# EAGLE design vmuzero_SEPS525_V1_0_ICHG100 (EAGLE 6.6.0)

## Sheet 1 of 5
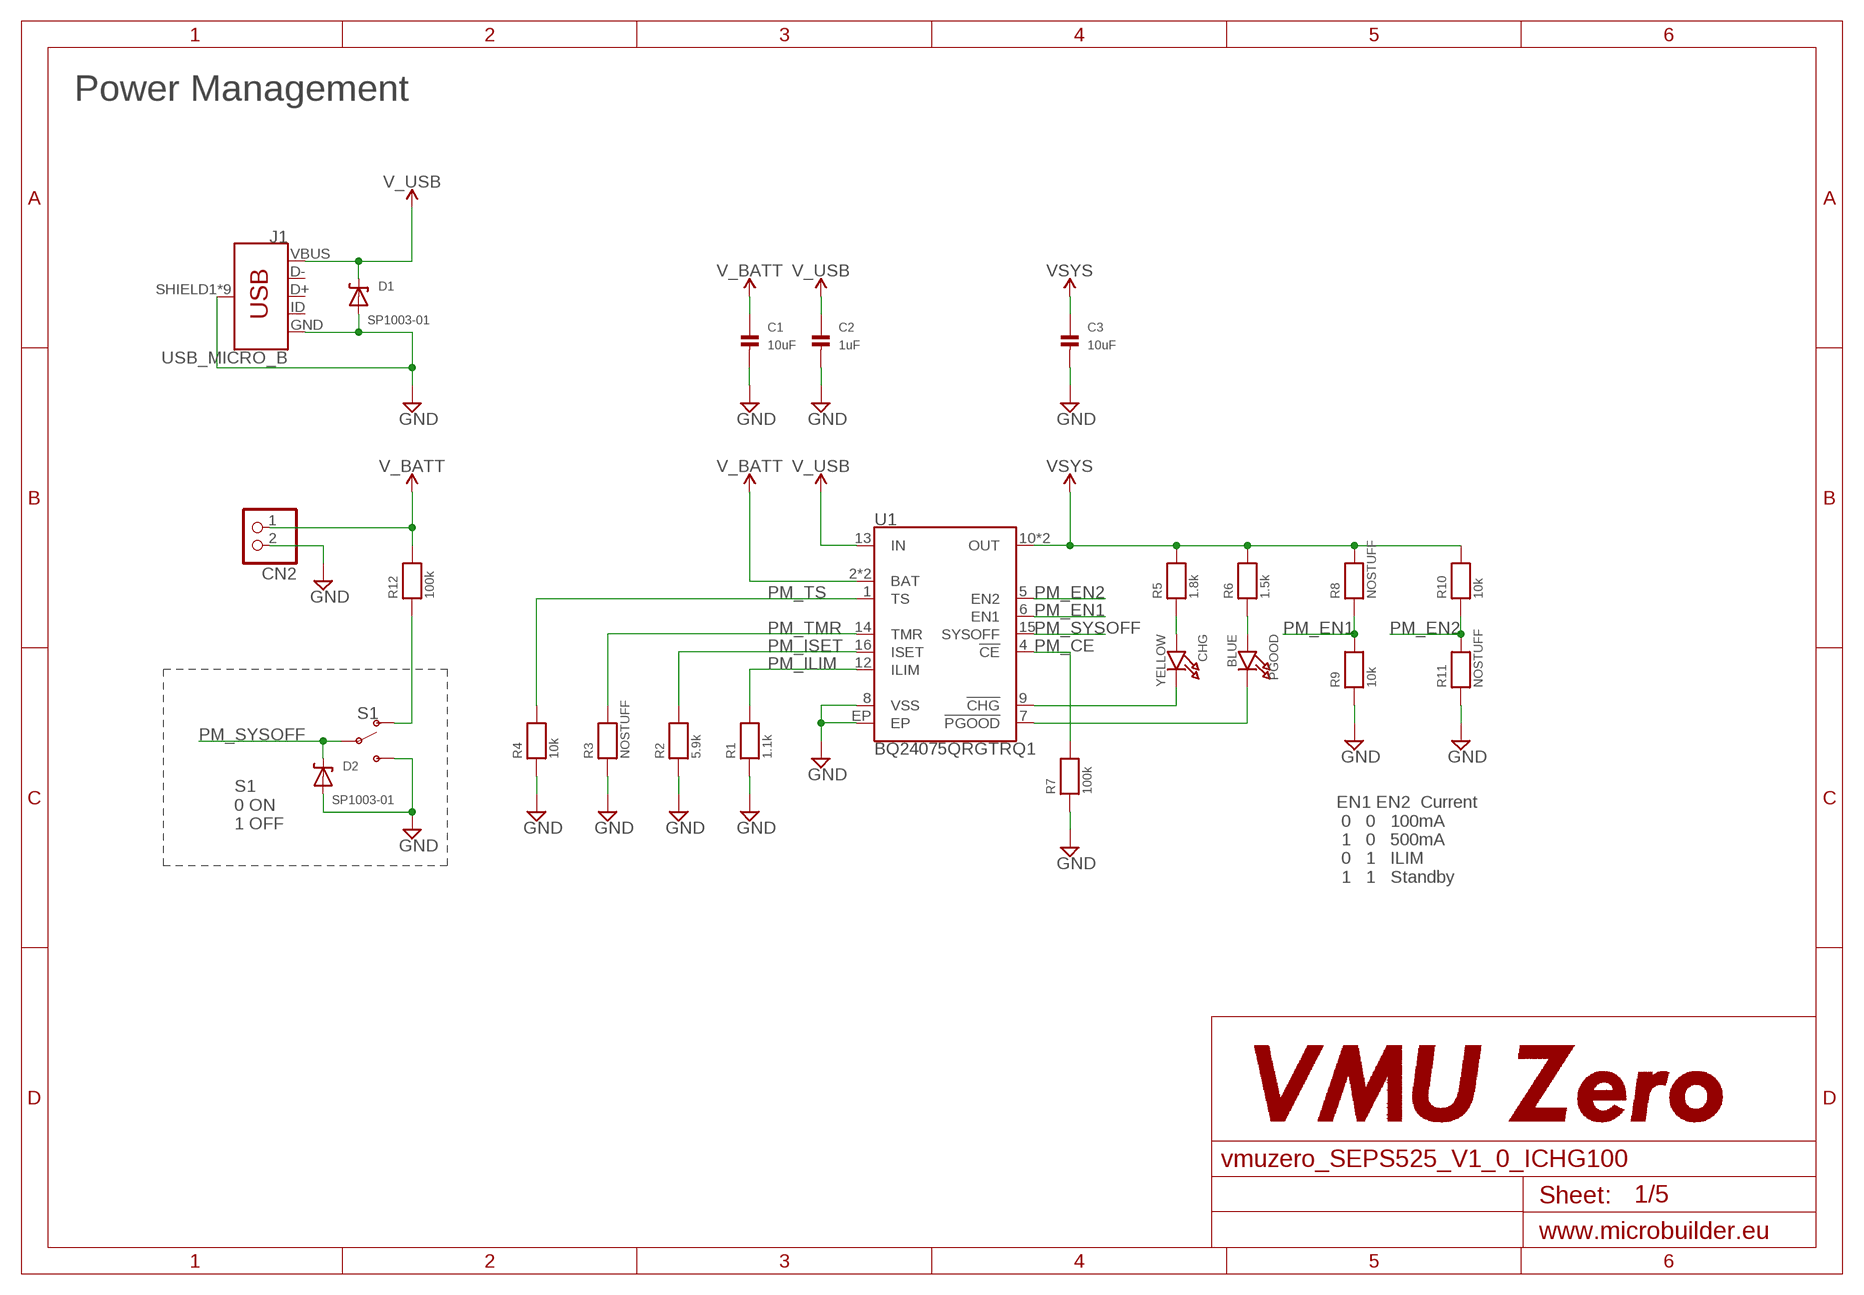
[diagram p0: schematic, sheet 1]

### Parts
C1  10uF  CAP_CERAMIC_0805MP  [_0805MP]
C2  1uF  CAP_CERAMIC_0805MP  [_0805MP]
C3  10uF  CAP_CERAMIC_0805MP  [_0805MP]
CHG  YELLOW  LED0805_NOOUTLINE  [CHIPLED_0805_NOOUTLINE]
CN2  JST_2PIN  [S2B-PH-K-S]
D1  SP1003-01  SP1003-01D  [DIODE_SOD723]
D2  SP1003-01  SP1003-01D  [DIODE_SOD723]
J1  USB_MICRO_B  USB_MICRO-B_CUI_MIBH2  [UJ2-MIBH2-4-SMT]
PGOOD  BLUE  LED0805_NOOUTLINE  [CHIPLED_0805_NOOUTLINE]
R1  1.1k  RESISTOR_0805MP  [_0805MP]
R2  5.9k  RESISTOR_0805MP  [_0805MP]
R3  NOSTUFF  RESISTOR_0805MP  [_0805MP]
R4  10k  RESISTOR_0805MP  [_0805MP]
R5  1.8k  RESISTOR_0805MP  [_0805MP]
R6  1.5k  RESISTOR_0805MP  [_0805MP]
R7  100k  RESISTOR_0805MP  [_0805MP]
R8  NOSTUFF  RESISTOR_0805MP  [_0805MP]
R9  10k  RESISTOR_0805MP  [_0805MP]
R10  10k  RESISTOR_0805MP  [_0805MP]
R11  NOSTUFF  RESISTOR_0805MP  [_0805MP]
R12  100k  RESISTOR_0805MP  [_0805MP]
S1  SWITCH-SPDT  [SPDT_JS102011SAQN]
U1  BQ24075QRGTRQ1  BQ24075  [PVQFN-N16]

### Nets
GND: C1.2 C2.2 C3.2 CN2.2 D1.A D2.A J1.GND J1.SHIELD1(SHIELD) J1.SHIELD2(SHIELD) J1.SHIELD3(SHIELD) J1.SHIELD5(SHIELD) J1.SHIELD6(SHIELD) J1.SHIELD7(SHIELD) J1.SHIELD8(SHIELD) J1.SHIELD9(SHIELD) J1.SHIELD10(SHIELD) R1.1 R2.1 R3.1 R4.1 R7.1 R9.1 R11.1 S1.P$3(S) U1.8(VSS) U1.EP ; also sheet 2,3,4,5
N$1: CHG.C U1.9(!CHG!)
N$2: PGOOD.C U1.7(!PGOOD!)
N$4: R12.1 S1.P$1(O)
N$5: PGOOD.A R6.1
N$6: CHG.A R5.1
PM_CE: R7.2 U1.4(!CE!)
PM_EN1: R8.1 R9.2 U1.6(EN1)
PM_EN2: R10.1 R11.2 U1.5(EN2)
PM_ILIM: R1.2 U1.12(ILIM)
PM_ISET: R2.2 U1.16(ISET)
PM_SYSOFF: D2.C S1.P$2(P) U1.15(SYSOFF)
PM_TMR: R3.2 U1.14(TMR)
PM_TS: R4.2 U1.1(TS)
V_BATT: C1.1 CN2.1 R12.2 U1.2(BAT) U1.3(BAT)
V_USB: C2.1 D1.C J1.VBUS U1.13(IN)
VSYS: C3.1 R5.2 R6.2 R8.2 R10.2 U1.10(OUT) U1.11(OUT) ; also sheet 2,4,5
Unconnected: J1.D+ J1.D- J1.ID

### Notes on the sheet
- Power Management
- S1
  0 ON
  1 OFF
- EN1 EN2  Current
   0   0   100mA
   1   0   500mA
   0   1   ILIM
   1   1   Standby

## Sheet 2 of 5
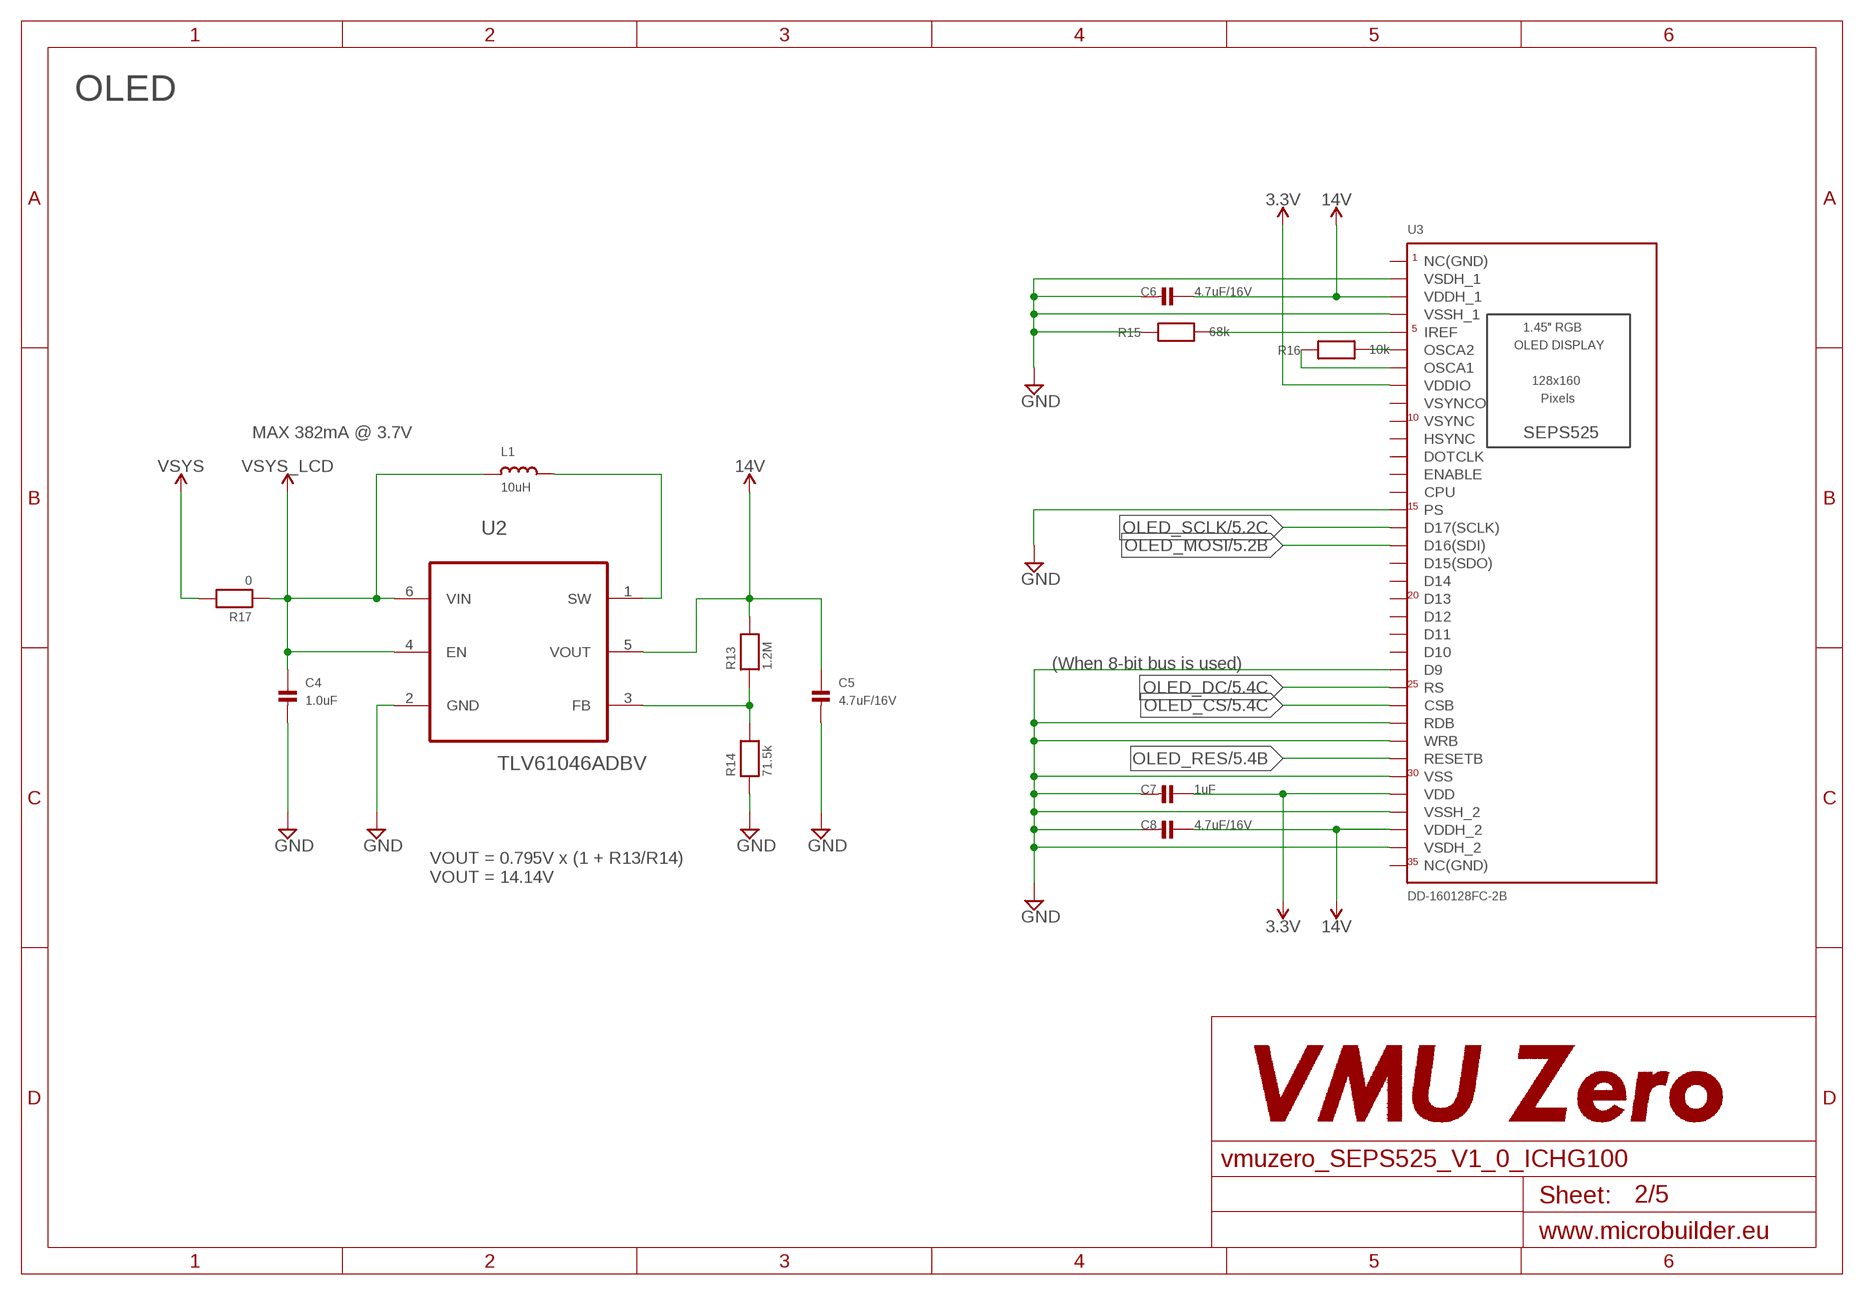
[diagram p1: schematic, sheet 2]

### Parts
C4  1.0uF  CAP_CERAMIC_0805MP  [_0805MP]
C5  4.7uF/16V  CAP_CERAMIC_0805MP  [_0805MP]
C6  4.7uF/16V  CAP_CERAMIC_0805MP  [_0805MP]
C7  1uF  CAP_CERAMIC_0805MP  [_0805MP]
C8  4.7uF/16V  CAP_CERAMIC_0805MP  [_0805MP]
L1  10uH  INDUCTOR_LQH2  [LQH2]
R13  1.2M  RESISTOR_0805MP  [_0805MP]
R14  71.5k  RESISTOR_0805MP  [_0805MP]
R15  68k  RESISTOR_0805MP  [_0805MP]
R16  10k  RESISTOR_0805MP  [_0805MP]
R17  0  RESISTOR_0805MP  [_0805MP]
U2  TLV61046ADBV  [R-PDSO-G6]
U3  DD-160128FC-2B  DISP_OLED_DD-160128FC-2BNOSWAP  [XF2M-3515-1A]

### Nets
3.3V: C7.1 U3.8(VDDIO) U3.31(VDD) ; also sheet 5
14V: C5.1 C6.1 C8.1 R13.2 U2.5(VOUT) U3.3(VDDH_1) U3.33(VDDH_2)
GND: C4.2 C5.2 C6.2 C7.2 C8.2 R14.1 R15.2 U2.2(GND) U3.2(VSDH_1) U3.4(VSSH_1) U3.15(PS) U3.24(D9) U3.27(RDB) U3.28(WRB) U3.30(VSS) U3.32(VSSH_2) U3.34(VSDH_2) ; also sheet 1,3,4,5
N$7: R15.1 U3.5(IREF)
N$8: L1.P$2 U2.1(SW)
N$9: R13.1 R14.2 U2.3(FB)
N$10: R16.1 U3.6(OSCA2)
N$11: R16.2 U3.7(OSCA1)
OLED_CS: U3.26(CSB) ; also sheet 5
OLED_DC: U3.25(RS) ; also sheet 5
OLED_MOSI: U3.17(D16(SDI)) ; also sheet 5
OLED_RES: U3.29(RESETB) ; also sheet 5
OLED_SCLK: U3.16(D17(SCLK)) ; also sheet 5
VSYS: R17.2 ; also sheet 1,4,5
VSYS_LCD: C4.1 L1.P$1 R17.1 U2.4(EN) U2.6(VIN)
Unconnected: U3.1(NC(GND)) U3.9(VSYNCO) U3.10(VSYNC) U3.11(HSYNC) U3.12(DOTCLK) U3.13(ENABLE) U3.14(CPU) U3.18(D15(SDO)) U3.19(D14) U3.20(D13) U3.21(D12) U3.22(D11) U3.23(D10) U3.35(NC(GND))

### Notes on the sheet
- OLED
- MAX 382mA @ 3.7V
- (When 8-bit bus is used)
- VOUT = 0.795V x (1 + R13/R14)
  VOUT = 14.14V

## Sheet 3 of 5
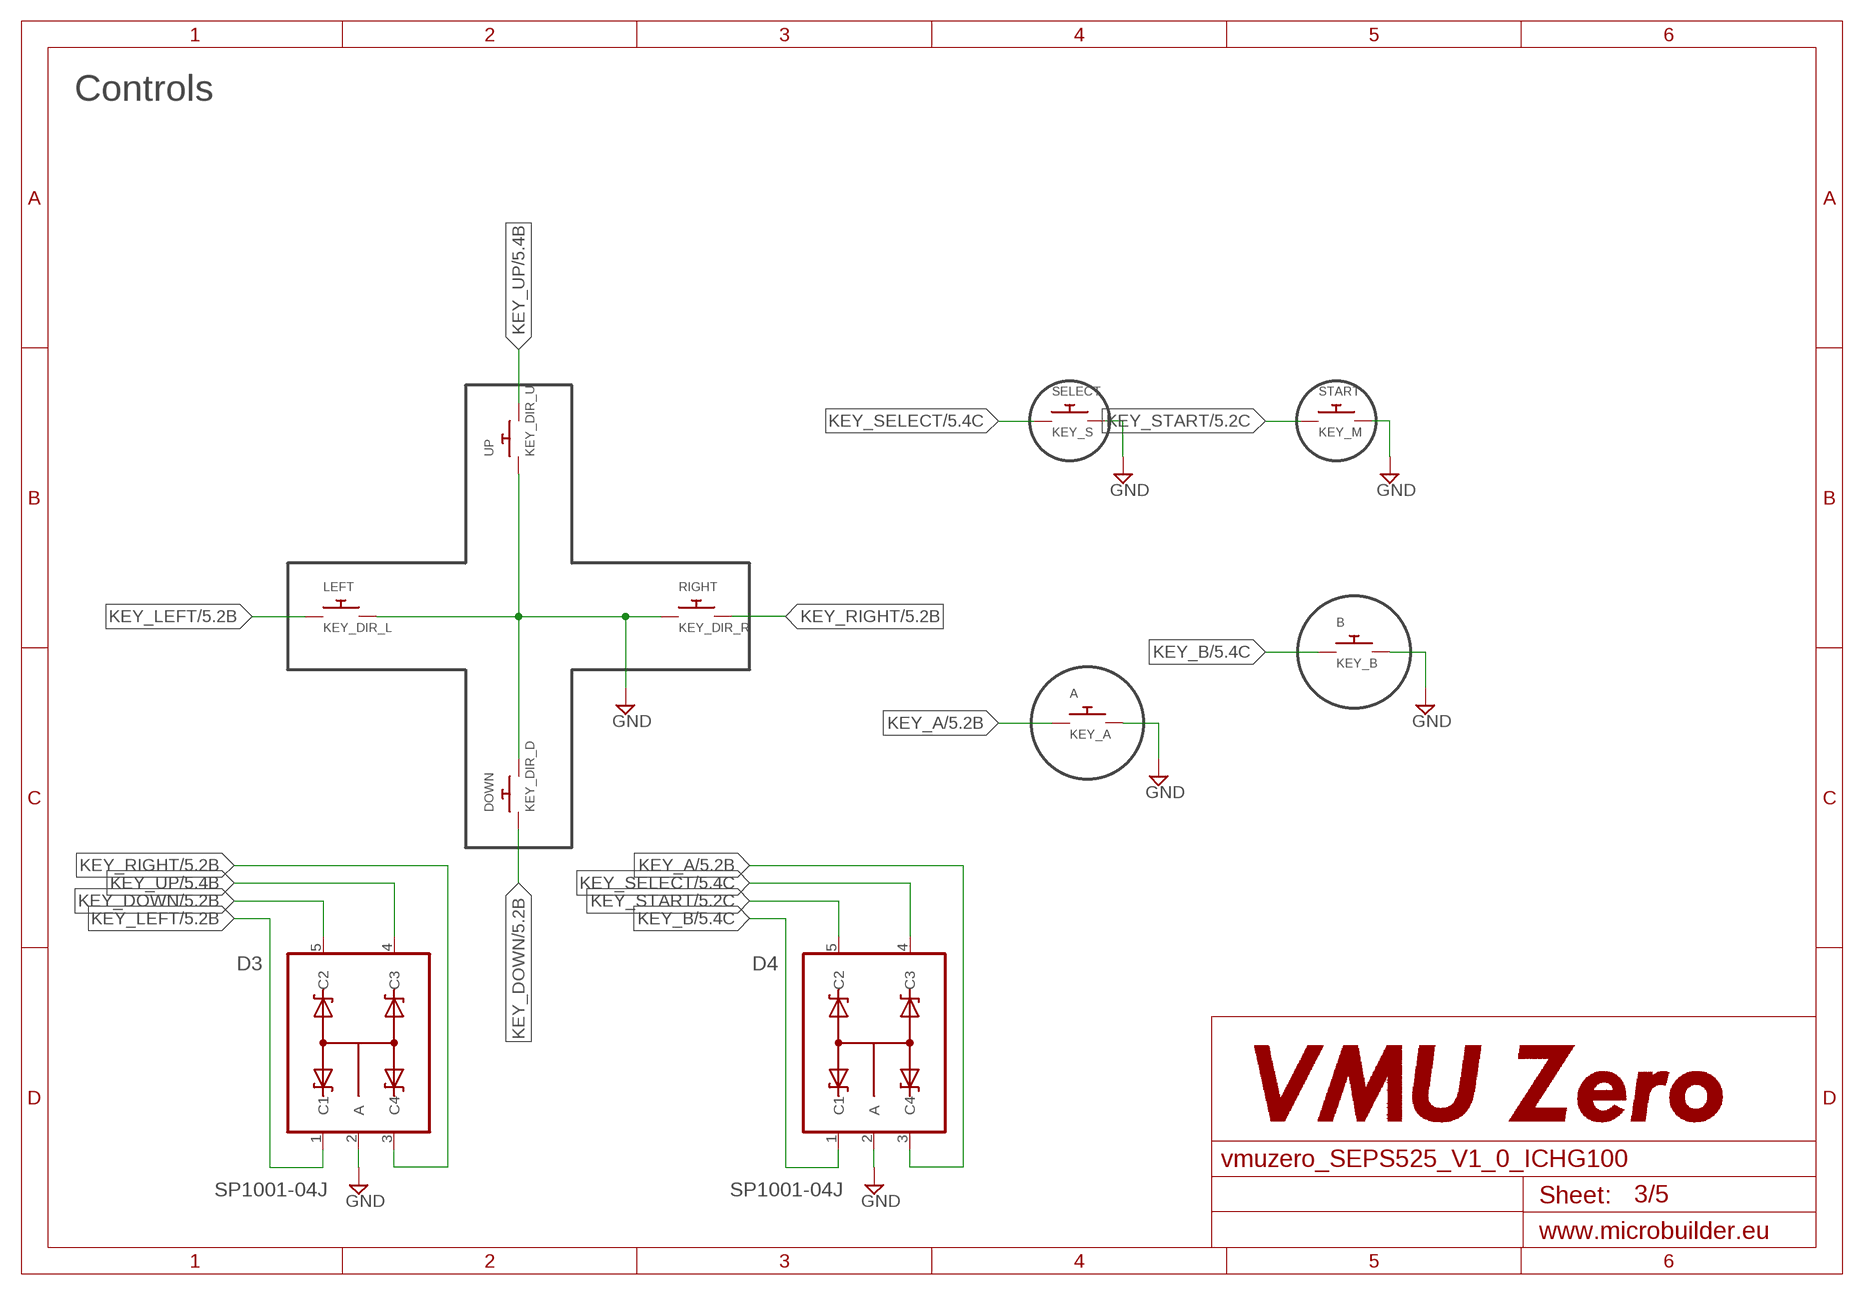
[diagram p2: schematic, sheet 3]

### Parts
A  KEY_A  SWITCH_PUSH_VMU  [KEYPAD_VMU_R26]
B  KEY_B  SWITCH_PUSH_VMU  [KEYPAD_VMU_R26]
D3  SP1001-04J  [SC70-5]
D4  SP1001-04J  [SC70-5]
DOWN  KEY_DIR_D  SWITCH_PUSH_VMU  [KEYPAD_VMU_R26]
LEFT  KEY_DIR_L  SWITCH_PUSH_VMU  [KEYPAD_VMU_R26]
RIGHT  KEY_DIR_R  SWITCH_PUSH_VMU  [KEYPAD_VMU_R26]
SELECT  KEY_S  SWITCH_PUSH_VMU  [KEYPAD_VMU_R26]
START  KEY_M  SWITCH_PUSH_VMU  [KEYPAD_VMU_R26]
UP  KEY_DIR_U  SWITCH_PUSH_VMU  [KEYPAD_VMU_R26]

### Nets
GND: A.2 B.2 D3.2(A) D4.2(A) DOWN.2 LEFT.2 RIGHT.1 SELECT.2 START.2 UP.1 ; also sheet 1,2,4,5
KEY_A: A.1 D4.3(C4) ; also sheet 5
KEY_B: B.1 D4.1(C1) ; also sheet 5
KEY_DOWN: D3.5(C2) DOWN.1 ; also sheet 5
KEY_LEFT: D3.1(C1) LEFT.1 ; also sheet 5
KEY_RIGHT: D3.3(C4) RIGHT.2 ; also sheet 5
KEY_SELECT: D4.4(C3) SELECT.1 ; also sheet 5
KEY_START: D4.5(C2) START.1 ; also sheet 5
KEY_UP: D3.4(C3) UP.2 ; also sheet 5

### Notes on the sheet
- Controls

## Sheet 4 of 5
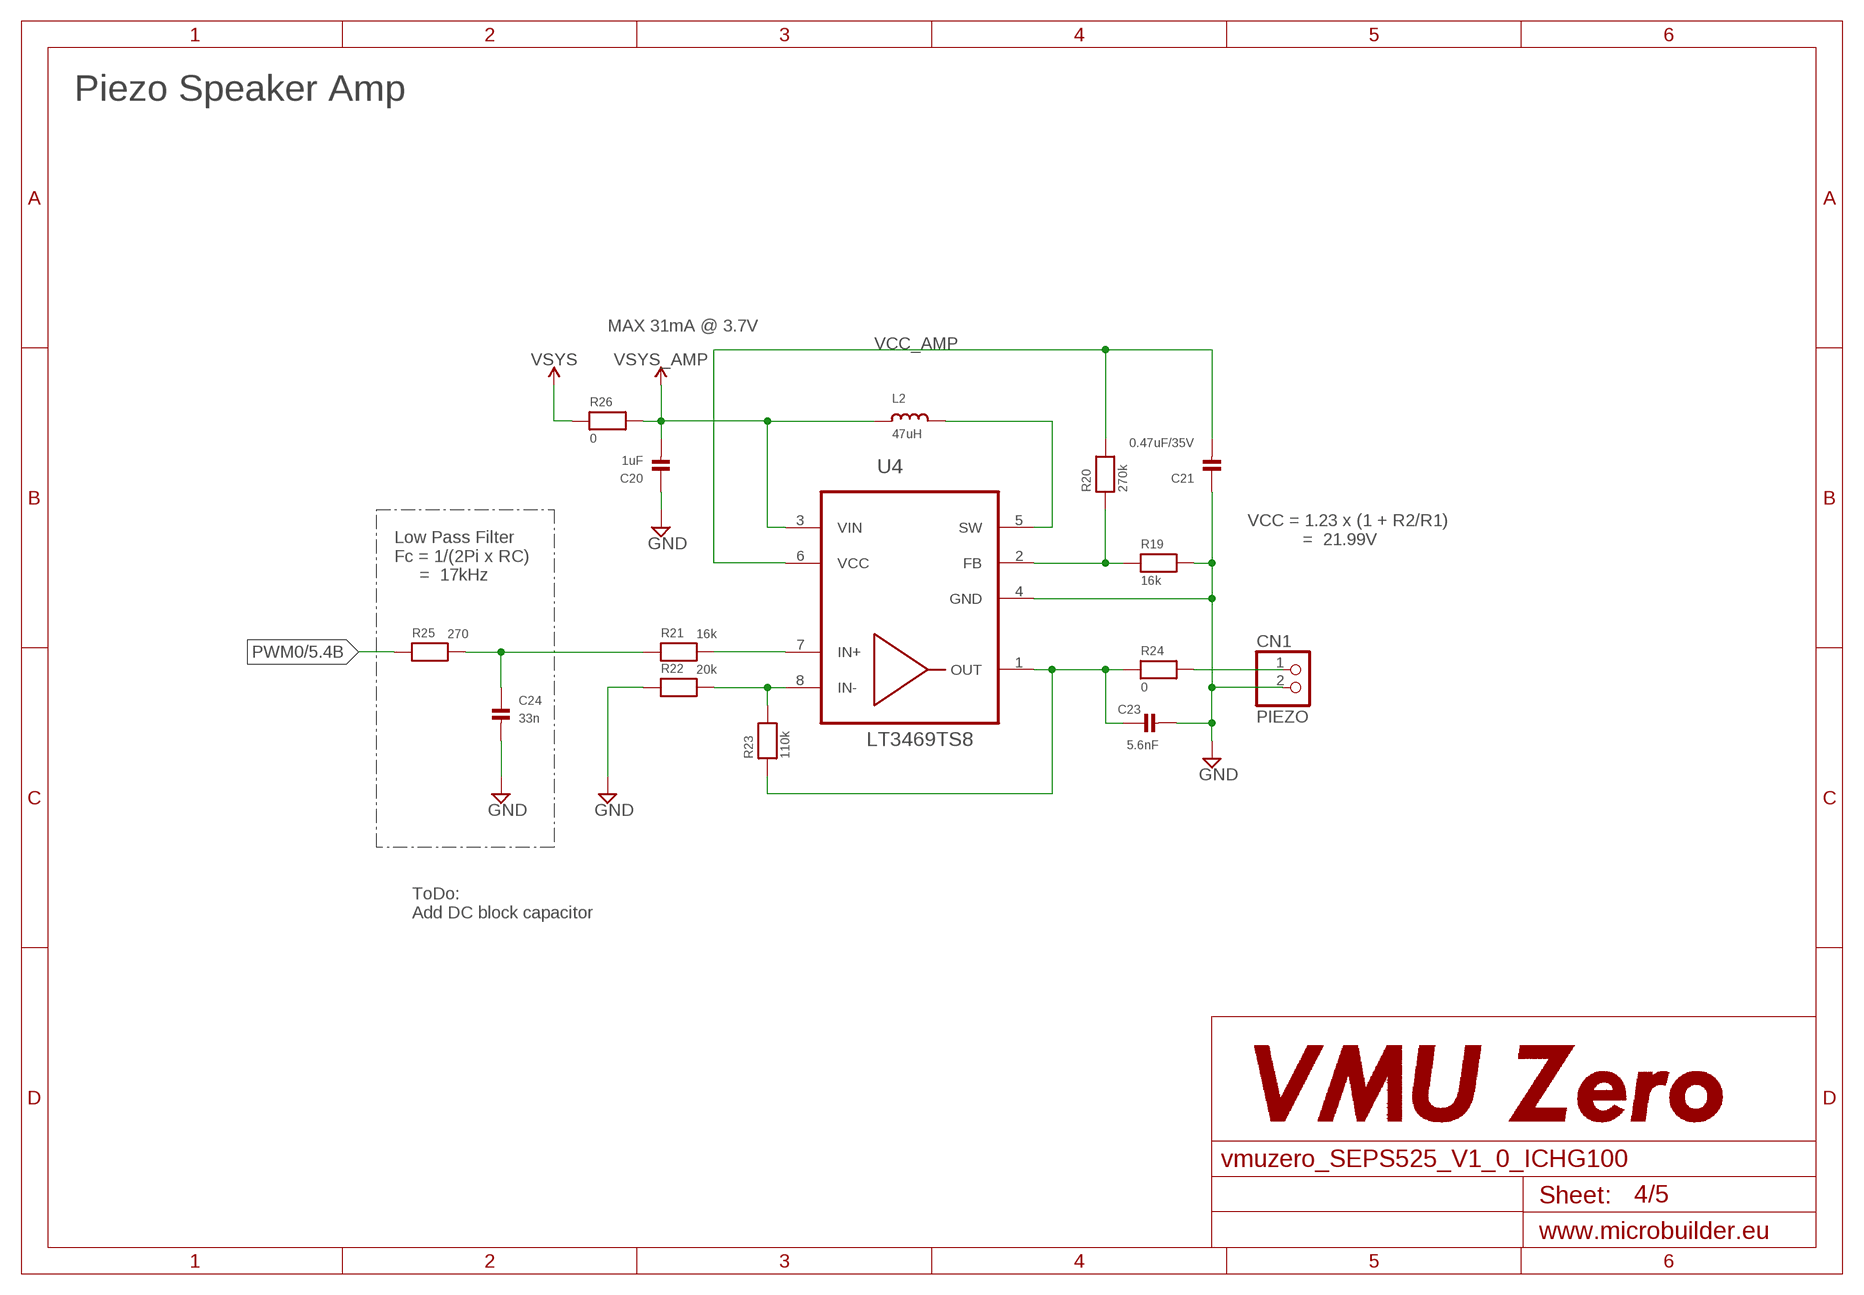
[diagram p3: schematic, sheet 4]

### Parts
C20  1uF  CAP_CERAMIC_0805MP  [_0805MP]
C21  0.47uF/35V  CAP_CERAMIC_0805MP  [_0805MP]
C23  5.6nF  CAP_CERAMIC_0805MP  [_0805MP]
C24  33n  CAP_CERAMIC_0805MP  [_0805MP]
CN1  PIEZO  HEADER-1X2ROUND  [1X02_ROUND]
L2  47uH  INDUCTOR_LQH32C  [LQH32C]
R19  16k  RESISTOR_0805MP  [_0805MP]
R20  270k  RESISTOR_0805MP  [_0805MP]
R21  16k  RESISTOR_0805MP  [_0805MP]
R22  20k  RESISTOR_0805MP  [_0805MP]
R23  110k  RESISTOR_0805MP  [_0805MP]
R24  0  RESISTOR_0805MP  [_0805MP]
R25  270  RESISTOR_0805MP  [_0805MP]
R26  0  RESISTOR_0805MP  [_0805MP]
U4  LT3469TS8  [TSOT-23-8]

### Nets
GND: C20.1 C21.1 C23.2 C24.2 CN1.2 R19.2 R22.1 U4.4(GND) ; also sheet 1,2,3,5
N$14: L2.P$2 U4.5(SW)
N$16: R19.1 R20.1 U4.2(FB)
N$17: C23.1 R23.1 R24.1 U4.1(OUT)
N$18: R22.2 R23.2 U4.8(IN-)
N$19: CN1.1 R24.2
N$20: C24.1 R21.1 R25.2
N$21: R21.2 U4.7(IN+)
PWM0: R25.1 ; also sheet 5
VCC_AMP: C21.2 R20.2 U4.6(VCC)
VSYS: R26.1 ; also sheet 1,2,5
VSYS_AMP: C20.2 L2.P$1 R26.2 U4.3(VIN)

### Notes on the sheet
- Piezo Speaker Amp
- MAX 31mA @ 3.7V
- VCC = 1.23 x (1 + R2/R1)
             =  21.99V
- Low Pass Filter
  Fc = 1/(2Pi x RC)
       =  17kHz
- ToDo:
  Add DC block capacitor

## Sheet 5 of 5
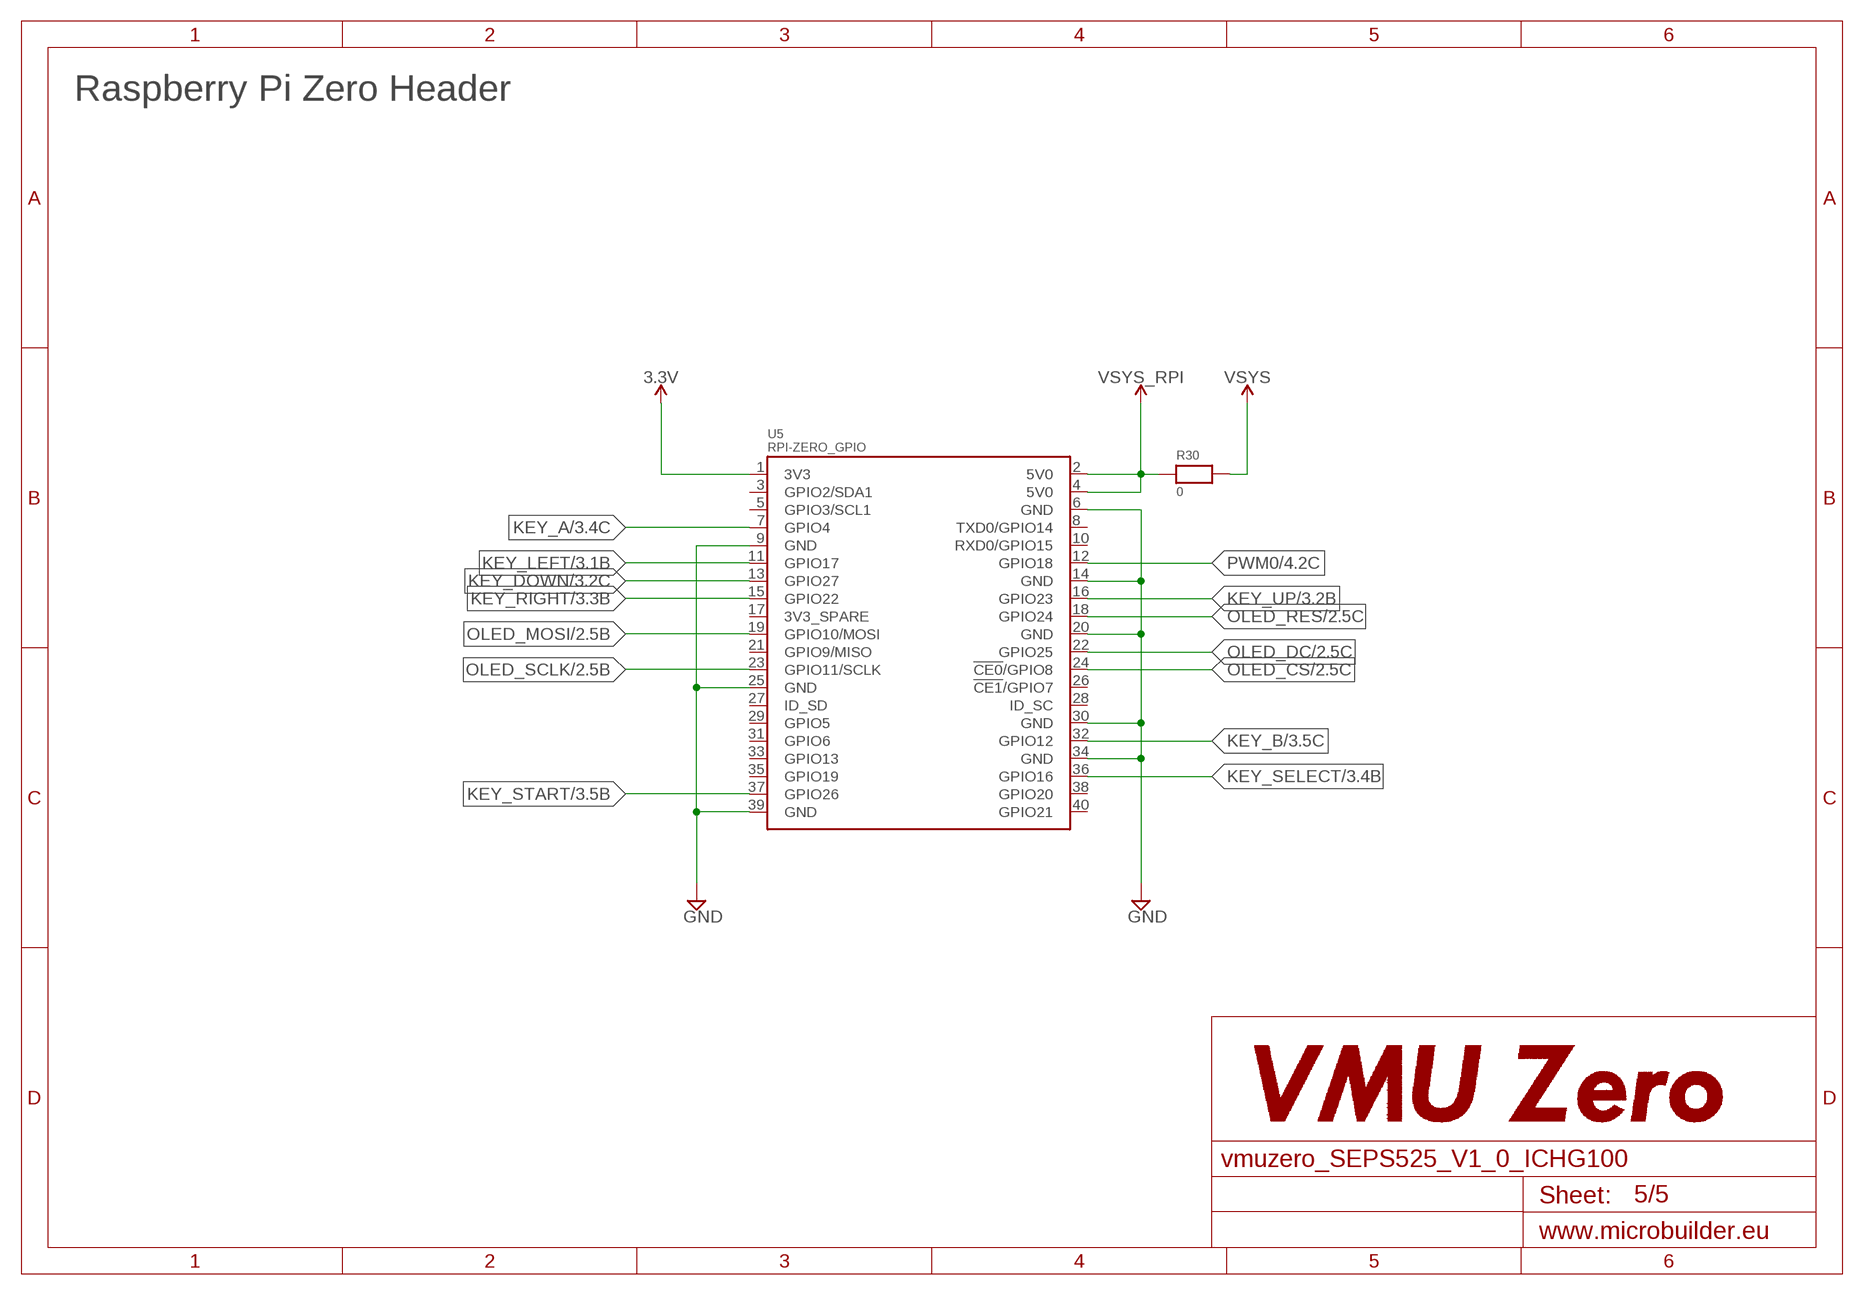
[diagram p4: schematic, sheet 5]

### Parts
R30  0  RESISTOR_0805MP  [_0805MP]
U5  RPI-ZERO_GPIO  [RASP_PI_ZERO_GPIO_SMD]

### Nets
3.3V: U5.1(3V3) ; also sheet 2
GND: U5.6(GND) U5.9(GND) U5.14(GND) U5.20(GND) U5.25(GND) U5.30(GND) U5.34(GND) U5.39(GND) ; also sheet 1,2,3,4
KEY_A: U5.7(GPIO4) ; also sheet 3
KEY_B: U5.32(GPIO12) ; also sheet 3
KEY_DOWN: U5.13(GPIO27) ; also sheet 3
KEY_LEFT: U5.11(GPIO17) ; also sheet 3
KEY_RIGHT: U5.15(GPIO22) ; also sheet 3
KEY_SELECT: U5.36(GPIO16) ; also sheet 3
KEY_START: U5.37(GPIO26) ; also sheet 3
KEY_UP: U5.16(GPIO23) ; also sheet 3
OLED_CS: U5.24(!CE0!/GPIO8) ; also sheet 2
OLED_DC: U5.22(GPIO25) ; also sheet 2
OLED_MOSI: U5.19(GPIO10/MOSI) ; also sheet 2
OLED_RES: U5.18(GPIO24) ; also sheet 2
OLED_SCLK: U5.23(GPIO11/SCLK) ; also sheet 2
PWM0: U5.12(GPIO18) ; also sheet 4
VSYS: R30.2 ; also sheet 1,2,4
VSYS_RPI: R30.1 U5.2(5V0) U5.4(5V0)
Unconnected: U5.3(GPIO2/SDA1) U5.5(GPIO3/SCL1) U5.8(TXD0/GPIO14) U5.10(RXD0/GPIO15) U5.17(3V3_SPARE) U5.21(GPIO9/MISO) U5.26(!CE1!/GPIO7) U5.27(ID_SD) U5.28(ID_SC) U5.29(GPIO5) U5.31(GPIO6) U5.33(GPIO13) U5.35(GPIO19) U5.38(GPIO20) U5.40(GPIO21)

### Notes on the sheet
- Raspberry Pi Zero Header

## Library data of the parts
A B DOWN LEFT RIGHT SELECT START UP = vmuzero:SWITCH_PUSH_VMU: Buttons SWITCH_PUSH_VMU - Soft touch temporary push button for VMU
C1-C8 C20 C21 C23 C24 = microbuilder:CAP_CERAMIC: Ceramic Capacitors 0402 - 0402 Surface Mount Capacitors 16pF 50V 5% [Digikey: 445-4899-2-ND] 18pF 50V 5% [Digikey: 490-1281-2-ND] 22pF 50V 5% [Digikey: 490-1283-2-ND] 68pF 50V 5% [Digikey: 490-1289-2-ND] 0.1uF 10V 10% [Digikey: 490-1318-2-ND] 1.0uF 6.3V 10% [Digikey: 490-1320-2-ND] 0603 - 0603 Surface Mount Capacitors 16 pF 50V 5% [Digikey: 445-5051-2-ND] 22 pF 50V [Digikey: PCC220ACVTR-ND] 33 pF 50V 5% [Digikey: 490-1415-1-ND] 56pF 50V 5% [Digikey: 490-1421-1-ND] 220pF 50V 5% [Digikey: 445-1285-1-ND] 680 pF 50V 2200 pF 50V 5% C0G [Digikey: 445-1297-1-ND] 5600 pF 100V 5% X7R [Digikey: 478-3711-1-ND] 0.1 µF 25V 10% [Digikey: PCC2277TR-ND] 0.22 µF 16V 10% X7R [Digikey: 445-1318-1-ND] 1.0 µF 25V 10% [Digikey: 445-5146-2-ND] 0603 - RF Specific 3pF 250V +/-0.1pF RF [Digikey: 712-1347-1-ND] 18 pF 250V 5% [Digikey: 478-3505-1-ND or 712-1322-1-ND] 56 pF 250V 5% C0G RF [Digikey: 490-4867-1-ND] 68 pF 250V RF [Digikey: 490-4868-1-ND] 0805 - 0805 Surface Mount Capacitors 220 pF 250V 2% RF Ceramic Capacitor [Digikey: 712-1398-1-ND] 1000 pF 50V 2% NP0 Ceramic Capacitor [Digikey: 478-3760-1-ND] 0.1 µF 25V 10% Ceramic Capacitor [Digikey: PCC1828TR-ND] 1.0 µF 16V 10% Ceramic Capacitor[Digikey: 490-1691-2-ND] 10.0 µF 10V 10% Ceramic Capacitor[Digikey: 709-1228-1-ND] 10.0 uF 16V 10% Ceramic Capacitor [Digikey: 478-5165-2-ND] 47 uF 6.3V 20% Ceramic Capacitor [Digikey: 587-1779-1-ND or 399-5506-1-ND] 1206 - 1206 Surface Mount Capacitors 47uF 10V 20% Ceramic Capacitor [Digikey: 490-5528-1-ND or 399-5508-1-ND or 445-6010-1-ND] 100uF 6.3V -20%, +80% Y5V Ceramic Capacitor (Digikey: 490-4512-1-ND, Mouser: 81-GRM31CF50J107ZE1L)
CHG PGOOD = microbuilder:LED: LED 0603 - 0603 Surface Mount Package 2mA: Green LED - Low Power (3.9mcd, 2ma, 1.7Vf) - Digikey: 475-2709-2-ND Orange LED - Low Power (9.8mcd, 2ma, 1.8Vf) - Digikey: 475-1194-2-ND Red LED - Low Power (5mcd, 2ma, 1.8Vf) - Digikey: 475-1195-2-ND Yellow LED - Low Power (7mcd, 2ma, 1.8Vf) - Digikey: 475-1196-2-ND 5mA: Blue LED - Low Power (17mcd, 5ma, 2.9Vf) - Digikey: LNJ937W8CRACT-ND 0805 - 0805 Surface Mount Package 2mA: Red LED (8.8mcd, 2mA, 1.8Vf, Clear) - Low Power [Digikey: 475-2510-1-ND] Green LED (5mcd, 2mA, 1.8Vf, Clear) - Low Power [Digikey: 475-2730-1-ND] Yellow LED (11.3mcd, 2mA, 1.8Vf, Clear) - Low Power [Digikey: 475-2555-1-ND] 20mA: Red LED (104mcd, 20mA, Diffused) - LS R976 [Digikey: 475-1278-6-ND] Red LED (12mcd, 20mA, 2.0Vf, Clear) - APT2012EC [Digikey: 754-1128-1-ND] Green LED (15mcd, 20mA, 2.2Vf, Clear) - APT2012GC [Digikey: 754-1131-1-ND] Orange LED (160mcd, 20mA, 2.1Vf, Clear) - APT2012SECK [Digikey: 754-1130-1-ND] 1206 - 1206 Surface Mount Package Green LED (26mcd, 20mA, Diffused) - LG N971 [Digikey: 475-1407-6-ND] Red LED (15mcd, 20mA, Diffused) - LH N974 [Digikey: 475-1416-6-ND]
CN1 = microbuilder:HEADER-1X2: PIN HEADER
CN2 = vmuzero:JST_2PIN: JST 2-Pin Connectors of various flavors SMT-RA (S2B-PH-SM4) 4UConnector #17311 SMT (B2B-PH-SM4) THM-RA (S2B-PH) THM (B2B-PH)
D1 D2 = vmuzero:SP1003-01: Zener Diode SMA: SP1003 Series - 30pF 30kV Unidirectional Discrete TVS; DIGIKEY: F3377CT-ND; MPN: SP1003-01; SUPPLIER: Littelfuse
D3 D4 = vmuzero:SP1001-04: SP1001 Series - 8pF 15kV Unidirectional TVS Array; DIGIKEY: F2895CT-ND; MPN: SP1001-04; PACKAGE: SC70-5; SUPPLIER: Littelfuse
J1 = vmuzero:USB_MICRO-B: USB Type Micro-B Connector; DIGIKEY: 102-4007-1-ND; MPN: UJ2-MIBH-4-SMT; SUPPLIER: CUI
L1 L2 = vmuzero:INDUCTOR: Inductors 1210 (3512 metric): Murata LQH32CN470K23L 47uH 170mA 1.7Ω H=2.2mm (Digikey: 490-2497-1-ND) Murata LQH32CN470K53L 47uH 170mA 1.7Ω H=1.7mm (Digikey: 490-4063-1-ND) 1008 (2520 metric): Murata LQH2HPZ100MJRL 10uH 830mA 456mΩ H=1.0mm (Digikey: 490-15888-1-ND ); SUPPLIER: Murata
R1-R17 R19-R26 R30 = microbuilder:RESISTOR: Resistors 0402 - 0402 Surface Mount Package 22 Ohm 1% 1/16W [Digikey: 311-22.0LRTR-ND] 33 Ohm 5% 1/16W 1.0K 5% 1/16W 1.5K 5% 1/16W 2.0K 1% 1/16W 10.0K 1% 1/16W [Digikey: 311-10.0KLRTR-ND] 10.0K 5% 1/16W [Digikey: RMCF0402JT10K0TR-ND] 12.1K 1% 1/16W [Digikey: 311-22.0LRTR-ND] 100.0K 5% 1/16W 0603 - 0603 Surface Mount Package 0 Ohm 1/10 Watt 1% Resistor 15 Ohm 1/10 Watt 1% Resistor 33 Ohm 1/10 Watt 1% Resistor 49.9 Ohm 1/10 Watt 1% Resistor 100 Ohm 1/10 Watt 1% Resistor 150 Ohm 1/10 Watt 1% Resistor 240 Ohm 1/10 Watt 1% Resistor 390 Ohm 1/10 Watt 1% Resistor 560 Ohm 1/10 Watt 1% Resistor 680 Ohm 1/10 Watt 1% Resistor 750 Ohm 1/10 Watt 1% Resistor 1.0K Ohm 1/10 Watt 1% Resistor 1.5K Ohm 1/10 Watt 1% Resistor 2.0K Ohm 1/10 Watt 1% Resistor 2.2K Ohm 1/10 Watt 1% Resistor 3.3K Ohm 1/10 Watt 1% Resistor 4.7K Ohm 1/10 Watt 1% Resistor 10.0K Ohm 1/10 Watt 1% Resistor 12.0K Ohm 1/10 Watt 1% Resistor 12.1K Ohm 1/10 Watt 1% Resistor 20.0K Ohm 1/10 Watt 1% Resistor 33.0K Ohm 1/10 Watt 1% Resistor 100.0K Ohm 1/10 Watt 1% Resistor 0805 - 0805 Surface Mount Package 0 Ohm 1/8 Watt 1% Resistor 33 Ohm 1/8 Watt 1% Resistor 100 Ohm 1/8 Watt 1% Resistor 150 Ohm 1/8 Watt 1% Resistor 200 Ohm 1/8 Watt 1% Resistor 240 Ohm 1/8 Watt 1% Resistor 330 Ohm 1/8 Watt 1% Resistor 390 Ohm 1/8 Watt 1% Resistor 470 Ohm 1/8 Watt 1% Resistor 1.0K Ohm 1/8 Watt 1% Resistor 1.5K Ohm 1/8 Watt 1% Resistor 2.0K Ohm 1/8 Watt 1% Resistor 4.7K Ohm 1/8 Watt 1% Resistor 5.1K Ohm 1/8 Watt 1% Resistor 5.6K Ohm 1/8 Watt 1% Resistor 10.0K Ohm 1/8 Watt 1% Resistor 22.0K Ohm 1/8 Watt 1% Resistor 33.0K Ohm 1/8 Watt 1% Resistor 100K Ohm 1/8 Watt 1% Resistor 1206 - 1206 Surface Mount Package 2012 - 2010 Surface Mount Package 0.11 Ohm 1/2 Watt 1% Resistor - Digikey: RHM.11UCT-ND
S1 = vmuzero:SWITCH-SPDT: Single Pole, Double Throw (SPDT) Switch Single-pole, double-throw (SPDT) switch.; DIGIKEY: 401-1999-1-ND; MPN: JS102011SAQN; SUPPLIER: C&K
U1 = SparkFun-IC-Power:BQ24075: Texas Instruments BQ24075 LiPo Battery Chargerand Power-Path Management IC The bq2407x series of devices are integrated Li-Ion linear chargers and system power path management devices targeted at space-limited portable applications. The devices operate from either a USB port or an AC adapter and support charge currents up to 1.5 A. The input voltage range with input overvoltage protection supports unregulated adapters. The USB input current limit accuracy and start up sequence allow the bq2407x to meet USB-IF inrush current specifications. Additionally, the input dynamic power management (VIN-DPM) prevents the charger from crashing incorrectly configured USB sources. Datasheet <http://www.ti.com/product/BQ24075/datasheet> SparkFun Products SparkFun Battery Babysitter <https://www.sparkfun.com/products/13777> (PRT-13777); PROD_ID: IC-13219
U2 = vmuzero:TLV61046A: 28V BOOST CONVERTER WITH INTEGRATED SWITCH AND POWER DIODE; DIGIKEY: 296-46927-1-ND; PACKAGE: SOT-23-6; SUPPLIER: Texas Instruments
U3 = vmuzero:DISP_OLED_DD-160128FC-2B: 128x160 1.45" RGB OLED - DD-160128FC-2B 35-Pin 0.5mm Pitch FPC Cable (Top+Bottom Contacts) - OMRON XF2M-3515-1A (Digikey: OR727TR-ND) This FPC connector has contacts on the top and bottom, but the appropriate pin needs to be selected depending on whether the OLED will be inserted right-side up (use the NOSWAP pinout) or upside-down (use the SWAP pinout).; DIGIKEY: OR727TR-ND; MPN: XF2M-3515-1A; SUPPLIER: Omron Electronics
U4 = vmuzero:LT3469: Piezo Microactuator Driver with Boost Regulator; DIGIKEY: LT3469ETS8#TRMPBF; MPN: LT3469ETS8; SUPPLIER: Linear Technology
U5 = vmuzero:RPI-ZERO_GPIO

## Board
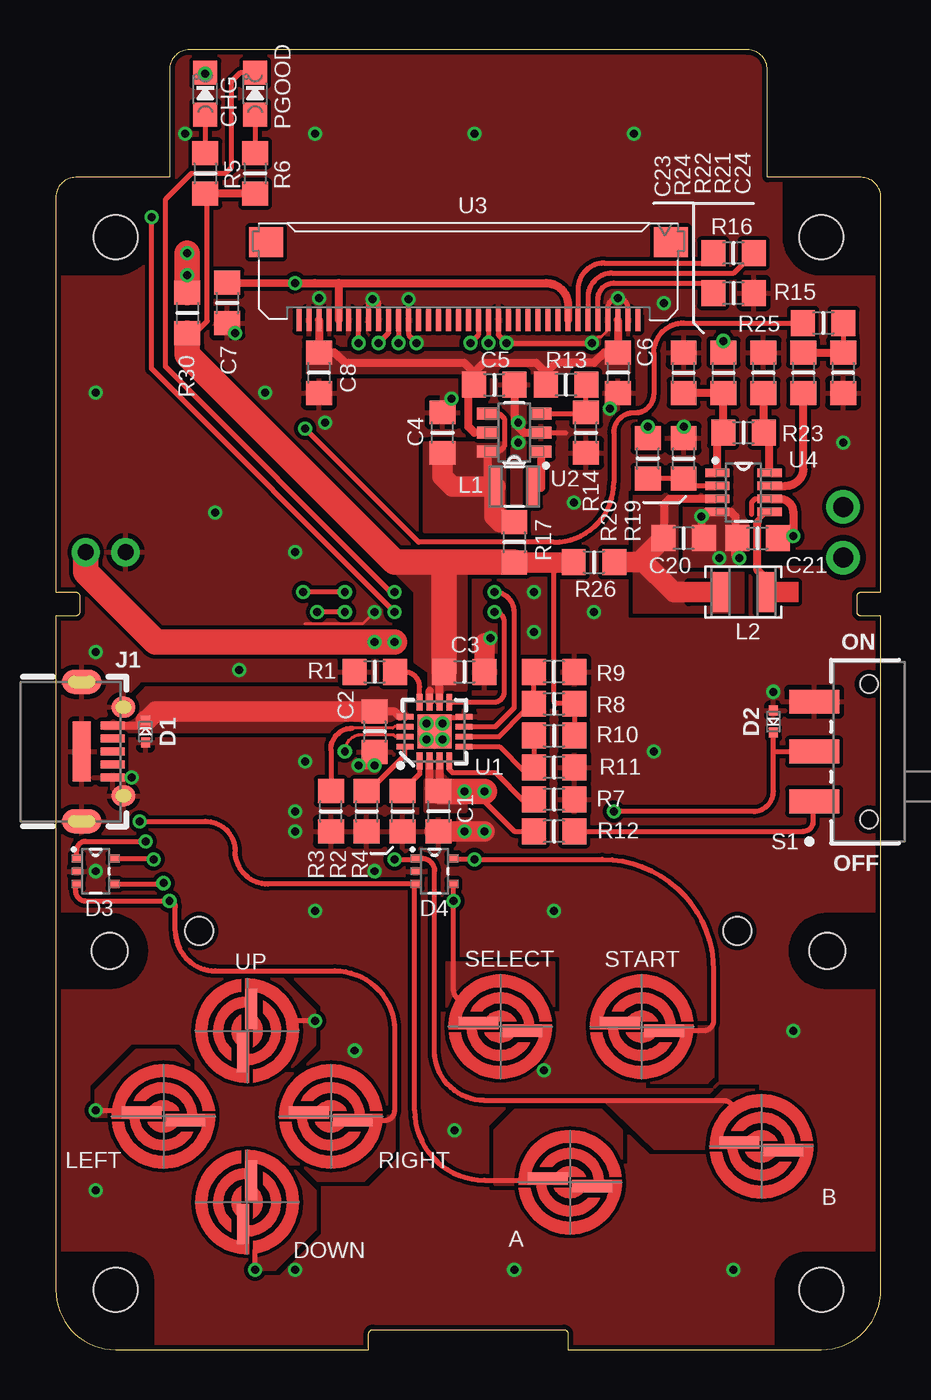
[diagram p5: board, top side]
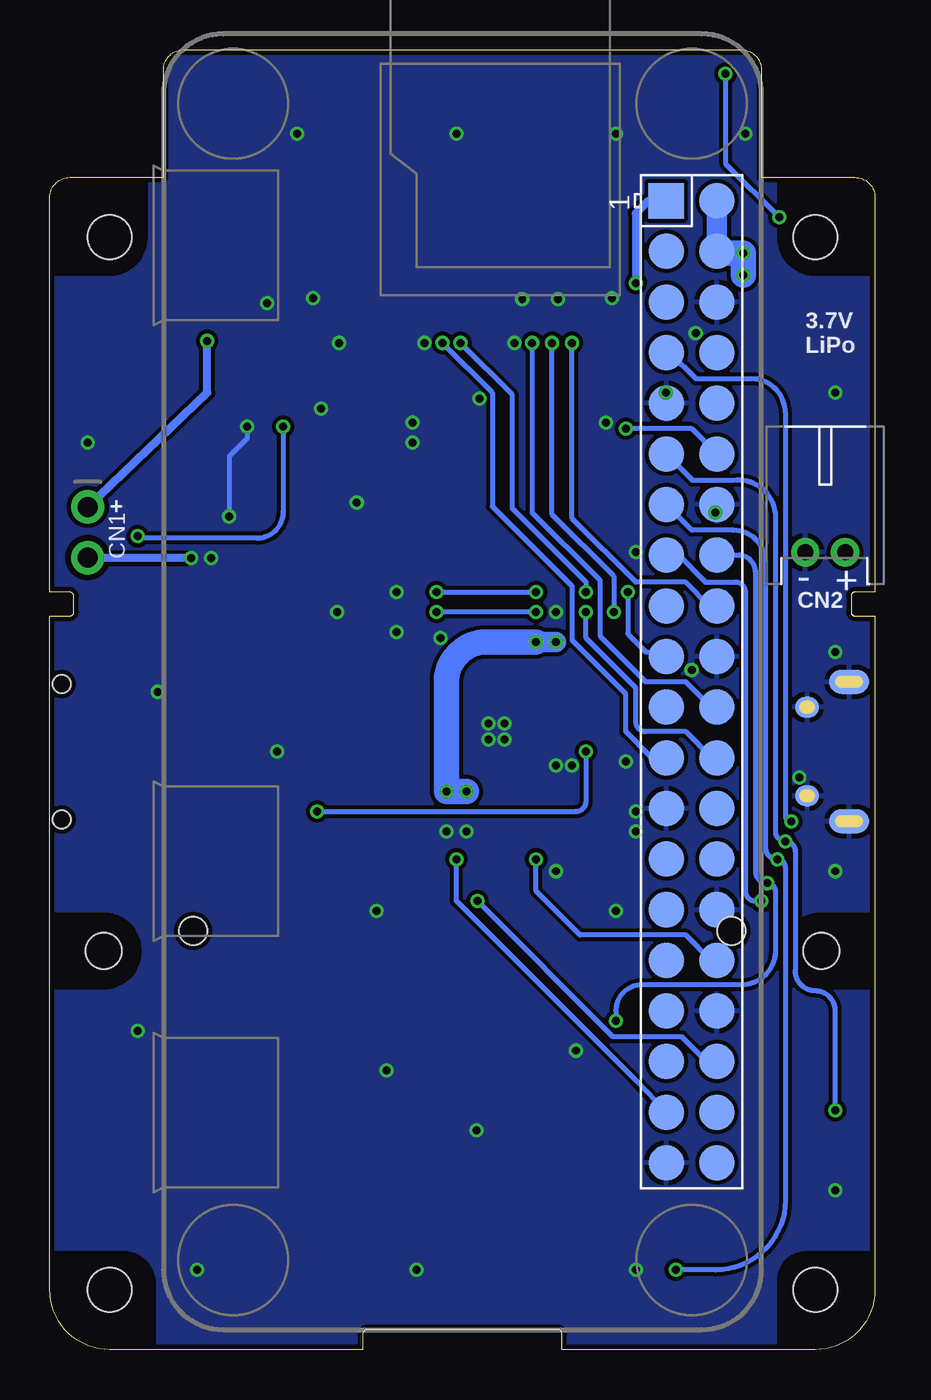
[diagram p6: board, bottom side, seen from below]

Size 41.4 x 65.2 mm. Coordinates in mm from the lower left corner, seen from the top.
Outline: 3,0 15.7,0 15.7,0.8 arc-90 15.9,1 25.5,1 arc-90 25.7,0.8 25.7,0 38.4,0 arc90 41.4,3 41.4,36.8 40.4,36.8 arc-90 40.2,37 40.2,37.8 arc-90 40.4,38 41.4,38 41.4,57.8 arc90 40.4,58.8 35.7,58.8 35.7,64.2 arc90 34.7,65.2 6.7,65.2 arc90 5.7,64.2 5.7,58.8 1,58.8 arc90 0,57.8 0,38 1,38 arc-90 1.2,37.8 1.2,37 arc-90 1,36.8 0,36.8 0,3 arc90 3,0
Copper layers (1*16): Top 0.035mm / dielectric 1.5mm / Bottom 0.035mm
Design rules "SeeedStudio_2layer_DRU_no_angle_20140221 *": minimum track width 6mil, minimum drill 12mil, track to track 6mil, track to pad 6mil, pad to pad 6mil, via to via 6mil, smd to smd 0mil, copper to edge 10mil, drill to drill 12mil, minimum pad ring 10mil, minimum via ring 6mil, stop-mask expansion 2mil, vias tented up to drill 100mil, thermal gap 10mil
Holes 2.2 mm at 3,3 38.4,3 3,55.8 38.4,55.8
Holes 1.8 mm at 2.7,20 38.7,20
Holes 1.4 mm at 7.2,21 34.2,21
tKeepout: area 0,20 to 41.4,22
tRestrict: area 38.7,38.9 to 40.3,40.5; 2 lines
bRestrict: area 38.7,38.9 to 40.3,40.5; 1 lines

### Footprints (pad centres in the part's own frame; a part is rotated, then mirrored left to right if it is on the bottom)
KEYPAD_VMU_R26 = smd 0.6 x 2: 1 -0.2,-1.1; 2 0.2,1.1
_0805MP = smd 1.2 x 1.3: 1 -1.016,0; 2 1.016,0
CHIPLED_0805_NOOUTLINE = smd 1.2 x 1.2: A 0,-1.05; C 0,1.05
1X02_ROUND = drill 1 pad 1.676: 1 -1.27,0; 2 1.27,0
S2B-PH-K-S = drill 0.8 pad 1.422: 1 1,0; 2 -1,0
DIODE_SOD723 = smd 0.5 x 0.45: A 0.55,0; C -0.55,0
SC70-5 = smd 0.5 x 0.4: 1 -0.95,0.65; 2 -0.95,0; 3 -0.95,-0.65; 4 0.95,-0.65; 5 0.95,0.65
UJ2-MIBH2-4-SMT = smd 1.2 x 0.4: D+ 2,0; D- 2,0.65; GND 2,-1.3; ID 2,-0.65; VBUS 2,1.3 | smd 2 x 1.2: SHIELD1 0.45,3.5; SHIELD5 0.45,-3.5 | smd 1.2 x 1.05: SHIELD2 2.55,2.225; SHIELD6 2.55,-2.225 | smd 0.9 x 3: SHIELD3 0.45,0 | smd 2 x 1.2 bottom: SHIELD7 0.45,3.5; SHIELD9 0.45,-3.5 | smd 1.2 x 1.05 bottom: SHIELD8 2.55,2.225; SHIELD10 2.55,-2.225
LQH2 = smd 0.625 x 2: P$1 -0.938,0; P$2 0.938,0
LQH32C = smd 1 x 2: P$1 -1.15,0; P$2 1.15,0
SPDT_JS102011SAQN = smd 1.2 x 2.5: P$1 -2.5,2.75; P$2 0,2.75; P$3 2.5,2.75 | hole 0.9: -3.4,0; 3.4,0
PVQFN-N16 = smd 0.28 x 0.85: 1 -0.75,-1.475; 2 -0.25,-1.475; 3 0.25,-1.475; 4 0.75,-1.475; 9 0.75,1.475; 10 0.25,1.475; 11 -0.25,1.475; 12 -0.75,1.475 | smd 0.85 x 0.28: 5 1.475,-0.75; 6 1.475,-0.25; 7 1.475,0.25; 8 1.475,0.75; 13 -1.475,0.75; 14 -1.475,0.25; 15 -1.475,-0.25; 16 -1.475,-0.75 | smd 1.7 x 1.7: EP 0,0
R-PDSO-G6 = smd 1.05 x 0.6: 1 -1.35,0.95; 2 -1.35,0; 3 -1.35,-0.95; 4 1.35,-0.95; 5 1.35,0; 6 1.35,0.95
XF2M-3515-1A = smd 1.1 x 0.25: 1 3.15,8.5; 2 3.15,8; 3 3.15,7.5; 4 3.15,7; 5 3.15,6.5; 6 3.15,6; 7 3.15,5.5; 8 3.15,5; 9 3.15,4.5; 10 3.15,4; 11 3.15,3.5; 12 3.15,3; 13 3.15,2.5; 14 3.15,2; 15 3.15,1.5; 16 3.15,1; 17 3.15,0.5; 18 3.15,0; 19 3.15,-0.5; 20 3.15,-1; 21 3.15,-1.5; 22 3.15,-2; 23 3.15,-2.5; 24 3.15,-3; 25 3.15,-3.5; 26 3.15,-4; 27 3.15,-4.5; 28 3.15,-5; 29 3.15,-5.5; 30 3.15,-6; 31 3.15,-6.5; 32 3.15,-7; 33 3.15,-7.5; 34 3.15,-8; 35 3.15,-8.5 | smd 1.5 x 1.7: M1 -0.75,10.15; M2 -0.75,-10.15
TSOT-23-8 = smd 1.22 x 0.42: 1 -1.31,0.975; 2 -1.31,0.325; 3 -1.31,-0.325; 4 -1.31,-0.975; 5 1.31,-0.975; 6 1.31,-0.325; 7 1.31,0.325; 8 1.31,0.975
RASP_PI_ZERO_GPIO_SMD = smd 1.778 x 1.778: 1 -24.13,-1.27; 2 -24.13,1.27; 3 -21.59,-1.27; 4 -21.59,1.27; 5 -19.05,-1.27; 6 -19.05,1.27; 7 -16.51,-1.27; 8 -16.51,1.27; 9 -13.97,-1.27; 10 -13.97,1.27; 11 -11.43,-1.27; 12 -11.43,1.27; 13 -8.89,-1.27; 14 -8.89,1.27; 15 -6.35,-1.27; 16 -6.35,1.27; 17 -3.81,-1.27; 18 -3.81,1.27; 19 -1.27,-1.27; 20 -1.27,1.27; 21 1.27,-1.27; 22 1.27,1.27; 23 3.81,-1.27; 24 3.81,1.27; 25 6.35,-1.27; 26 6.35,1.27; 27 8.89,-1.27; 28 8.89,1.27; 29 11.43,-1.27; 30 11.43,1.27; 31 13.97,-1.27; 32 13.97,1.27; 33 16.51,-1.27; 34 16.51,1.27; 35 19.05,-1.27; 36 19.05,1.27; 37 21.59,-1.27; 38 21.59,1.27; 39 24.13,-1.27; 40 24.13,1.27

### Placement (x,y rotation side)
A  25.8,8.4 270 top
B  35.4,10.2 270 top
C1  19.2,27 270 top
C2  16,31 270 top
C3  20.5,34 0 top
C4  19.4,46 90 top
C5  22,48.4 0 top
C6  28.2,49 270 top
C7  8.6,52.5 270 top
C8  13.2,49 270 top
C20  31.5,40.7 180 top
C21  35.2,40.7 0 top
C23  31.5,49 90 top
C24  39.5,49 270 top
CHG  7.5,63 0 top
CN1  39.5,41 270 bottom
CN2  2.5,40 0 bottom
D1  4.5,31 270 top
D2  36,31.5 90 top
D3  2,24 0 top
D4  19,24 0 top
DOWN  9.6,7.4 180 top
J1  0.85,30 0 top
L1  23,43.3 0 top
L2  34.5,38 0 top
LEFT  5.4,11.7 270 top
PGOOD  10,63 0 top
R1  16,34 0 top
R2  590  [_0805MP]  15.6,27 90 top
R3  13.8,27 90 top
R4  17.4,27 90 top
R5  7.5,59 270 top
R6  10,59 270 top
R7  25,27.6 180 top
R8  25,32.4 0 top
R9  25,34 180 top
R10  NOSTUFF  [_0805MP]  25,30.8 0 top
R11  10k  [_0805MP]  25,29.2 180 top
R12  25,26 180 top
R13  25.6,48.4 180 top
R14  26.6,46 90 top
R15  34,53 0 top
R16  34,55 180 top
R17  23,40.5 270 top
R19  31.5,44.7 90 top
R20  29.7,44.7 90 top
R21  37.5,49 270 top
R22  35.5,49 270 top
R23  34.5,46 0 top
R24  33.5,49 90 top
R25  38.5,51.5 0 top
R26  27,39.5 0 top
R30  6.6,52 270 top
RIGHT  13.8,11.7 270 top
S1  40.8,30 90 top
SELECT  22.3,16.2 270 top
START  29.4,16.2 90 top
U1  19,31 0 top
U2  23,46 180 top
U3  20.7,54.8 270 top
U4  34.5,43 0 top
U5  9.2,33.5 270 bottom
UP  9.6,16 0 top

### Tracks (layer width: path | path; a pad name or v marks a point on that pad's centre or on a via)
3.3V  (via drill 0.4)
  Top 0.406: C7.1 v12,53.51 13,53.5 14.2,53.5 | 14.2,53.5 24.6,53.5 arc-90 25.7,52.4 U3.8 | U3.31 14.2,53.5
  Bottom 0.406: U5.1 11.37,57.63 12,57 v12,53.51
14V
  Top 0.254: C5.1 20.98,49 | 24.6,49 24.6,48.42 R13.2
  Top 0.406: U3.33 C8.1 13.98,50.02 14.5,49.5 20.48,49.5 20.98,49 21.48,49.5 24.1,49.5 24.6,49 25.1,49.5 27,49.5 27.52,50.02 C6.1 U3.3 | U2.5 21,46 20.7,46.3 20.7,48.12 C5.1
  pour Top (isolate 0.203, rank 2, no thermals): 12.6,49 28.8,49 28.8,50 12.6,50
GND  (via drill 0.4)
  Top 0.152: U3.4 27.7,51.15 27.35,50.8 27.2,50.8 v26.9,50.5 | 12.5,36.41 15.41,36.41 v16,37
  Top 0.254: U2.2 25.58,46 | R19.2 v31.5,46.3 | U3.4 27.7,52.25 arc-90 v28.2,52.75 arc-90 28.7,52.25 U3.2 | U3.15 22.2,50.9 v22.6,50.5 v26.9,50.5 | v18.1,50.5 17.7,50.9 U3.24 v17.7,52.7 | U3.28 15.7,52.5 arc-90 v15.9,52.7 arc-90 16.2,52.4 U3.27 | v19.4,31.4 19.5,31.4 19.8,31.7 20.43,31.7 U1.8
  Top 0.406: C5.2 23.02,46.48 23.5,46 U2.2 | 32.5,40.82 C20.1 32.4,40.82 v32.4,41.8 32.62,42.02 U4.4 33.88,42.02 34.1,41.8 34.1,40.88 C21.1 34.1,40.62 34.1,39.8 34.2,39.7 v34.3,39.7 | C2.2 v16,29.3 v15.2,29.3 | 21.52,35.42 v21.8,35.7
  Top 1.016: 19,26 v21.5,26 | C3.2 21.52,35.42
  Bottom 0.254: v32.4,41.8 32.4,44.8 31.5,45.7 v31.5,46.3
  Bottom 0.406: v34.3,39.7 39.47,39.7 CN1.2
  other vias: 33.3,39.7 18.6,30.6 19.4,30.6 18.6,31.4 20.5,26 24,36 24,38 30.5,52.5 13.2,52.75 13,61 21,61 29,61 27,37 39.5,45.5 30,30 36,33 23,4 34,4 12,4 13.5,46.5 27.8,47.2 9,51 2,24 16,24 37,16 25,22 13,22 12,26 2,35 2,48 6.5,61 23.2,46.5 23.2,45.5 19.85,47.7 3.8,28.7 12,27 26,42.5 9.2,34.1 2,8 15,15 20,11 24.5,14 8,42 10.5,48 12,40 12.5,29.5
  pour Top (isolate 0.203, no thermals): 31.5,39.3 35.6,39.3 35.6,45.4 33.4,45.4 33.4,42.3 31.5,42.3
  pour Top (isolate 0.203, rank 6): 0,5 3.5,5 arc-90 5,3.5 5,0 36,0 36,3.5 arc-90 37.9,5 41.4,5 41.4,18 38.7,18 arc-90 36.7,20 arc-90 38.7,22 41.4,22 41.4,53.8 38.4,53.8 arc-90 36.4,55.8 36.4,65.2 5,65.2 5,55.8 arc-90 3,53.8 0,53.8 0,22 2.7,22 arc-90 4.7,20 arc-90 2.7,18 0,18
  pour Top: 12,52 32,52 32,53.5 12,53.5
  pour Bottom (isolate 0.203, rank 6): 0,5 3.5,5 arc-90 5,3.5 5,0 36,0 36,3.5 arc-90 37.9,5 41.4,5 41.4,18 38.7,18 arc-90 36.7,20 arc-90 38.7,22 41.4,22 41.4,53.8 38.4,53.8 arc-90 36.4,55.8 36.4,65.2 5,65.2 5,55.8 arc-90 3,53.8 0,53.8 0,22 2.7,22 arc-90 4.7,20 arc-90 2.7,18 0,18
  pour Top (rank 6, no thermals): 5.5,3 5.5,1.25 35.5,1.25 35.5,3
KEY_A  (via drill 0.4)
  Top 0.254: v4.2,26.5 7.5,26.5 arc-90 9,25 arc90 10.65,23.35 D4.3 18,23.3 18,12 arc90 21.5,8.5 24.6,8.5 | 24.6,8.5 A.1 arc-90 24.6,8.5
  Bottom 0.254: 10.49,50.01 U5.7 10.31,50.01 9,48.7 6.2,48.7 arc90 4.5,47 4.5,26.8 arc-90 v4.2,26.5
  pour Top (isolate 0.203): 22,8.3 28.4,8.3 28.4,11 27.4,12 23,12 22,11
KEY_B  (via drill 0.4)
  Top 0.254: v17,24.6 18,24.6 D4.1 18.35,24.65 arc-90 19,24 19,15 arc90 21.5,12.5 33.5,12.5 arc-90 34,12 33,10.5 B.1
  Bottom 0.254: U5.32 8.23,19.53 9.5,20.8 14.8,20.8 17,23 v17,24.6
  pour Top (isolate 0.203, no thermals): 30,10.1 38.1,10.1 38.1,12.6 37.7,13 33.5,13 33,12.5 27.5,12.5
KEY_DOWN  (via drill 0.4)
  Top 0.254: v10,4 10,5 11,5.5 11.5,6 12,7 12,8 10.5,9.5 10,9.5 DOWN.1 | D3.5 4.85,24.65 v4.9,24.6
  Bottom 0.254: 10.39,42.39 U5.13 9.18,41.1 7.1,41.1 arc90 5.5,39.5 5.5,25.2 arc-90 v4.9,24.6 arc90 4.5,24.2 4.5,7.5 arc90 8,4 v10,4
  pour Top (isolate 0.203): 10,4 10,10.3 10.7,10.3 13,8 13,6 11,4
KEY_LEFT  (via drill 0.4)
  Top 0.254: v2,12 4.2,12 LEFT.1 | D3.1 1.05,25.05 arc-90 1.5,25.5 v4.5,25.5
  Bottom 0.254: 10.43,44.93 U5.11 9.14,43.6 7.1,43.6 arc90 5,42 5,26 arc-90 v4.5,25.5 arc90 4,25 4,19 arc-90 3,18 arc90 2,17 v2,12
  pour Top (isolate 0.203): 2,11.7 8,11.7 8,12.9 8,13 6,15 4,15 2,13
KEY_RIGHT  (via drill 0.4)
  Top 0.254: D3.3 arc90 1,23.3 1,23 arc90 1.5,22.5 v5.7,22.5 arc-90 6,22.2 6,21 arc90 8,19 14,19 arc-90 17,16 17,12 arc-90 16.5,11.5 RIGHT.2
  Bottom 0.254: U5.15 9.85,39.85 8.5,38.5 7,38.5 arc90 6.5,38 6.5,23 arc-90 6,22.5 v5.7,22.5
  pour Top (isolate 0.203): 17,11.7 11.2,11.7 11.2,10.4 13.1,8.5 15.5,8.5 17,10
KEY_SELECT  (via drill 0.4)
  Top 0.254: D4.4 v19.95,22.5 19.95,18.05 arc90 20.5,17.5 20,17 20,16.5 20.1,16.4 SELECT.1
  Bottom 0.254: U5.36 8.45,14.45 9.7,15.7 13.15,15.7 v19.95,22.5
  pour Top (isolate 0.203, no thermals): 19.6,16.1 25,16.1 25,19.4 19.6,19.4
KEY_START  (via drill 0.4)
  Top 0.254: D4.5 20,24.6 v21,24.6 27.4,24.6 arc-90 33,19 33,16.5 arc-90 32.5,16 START.1
  Bottom 0.254: v21,24.6 21,22.5 12,13.5 U5.37
  pour Top (isolate 0.203): 33,16.2 26,16.2 26,13.8 26.4,13.4 32.7,13.4 33,13.7
KEY_UP  (via drill 0.4)
  Top 0.254: D3.4 5.35,23.35 v5.4,23.4 | v13,16.5 12,16.5 11.5,17 11.5,17.5 11,18 10.5,18.3 10,18.3 UP.2
  Bottom 0.254: U5.16 6.85,39.85 arc90 6,39 6,24 arc-90 v5.4,23.4 arc90 5,23 5,20 arc90 6.7,18.3 11.7,18.3 arc-90 13,17 v13,16.5
  pour Top (isolate 0.203, no thermals): 9.6,18.7 9.6,13.3 11,13.3 13,15.3 13,17 11.3,18.7
N$1  (via drill 0.4)
  Top 0.203: CHG.C v7.5,64
  Top 0.254: U1.9 21.98,32.48 arc90 22.5,33 22.5,36.5 arc90 v22,37 | v17,37 4.8,49.2 v4.8,56.8
  Bottom 0.254: v17,37 v22,37 | v7.5,64 7.5,59.5 v4.8,56.8
N$2  (via drill 0.4)
  Top 0.254: U1.7 22.05,31.25 23,32.2 23,37 arc90 v22,38 | v17,38 16.8,38 5.5,49.3 5.5,57.7 6.8,59 8.5,59 8.8,59.3 8.8,63.6 9.25,64.05 PGOOD.C
  Bottom 0.254: v22,38 v17,38
N$4
  Top 0.254: R12.1 37.5,26 arc90 38,26.5 38,27.45 arc-90 S1.P$1
N$5
  Top 0.254: PGOOD.A R6.1
N$6
  Top 0.254: CHG.A R5.1
N$7
  Top 0.254: U3.5 27.2,52.7 arc-90 28,53.5 33,53.5 33,53.02 R15.1
N$8
  Top 0.406: U2.1 24.35,43.22 L1.P$2
N$9
  Top 0.254: R13.1 26.6,48.38 R14.2 26.53,46.95 U2.3
N$10
  Top 0.254: R16.1 34.02,54 27.9,54 arc90 26.7,52.8 U3.6
N$11
  Top 0.254: R16.2 32.48,54.5 27.5,54.5 arc90 26.2,53.2 U3.7
N$14
  Top 0.254: 35.5,42 35.78,42 U4.5 35.62,42.02 35.2,41.6 35.2,41.5
  Top 0.406: L2.P$2 35.65,38.65 35.2,39.1 35.2,41.5
N$16
  Top 0.254: U4.2 31.86,43.33 R19.1 R20.1
N$17
  Top 0.406: U4.1 33.19,45.71 R23.1 33.48,47.97 R24.1 C23.1
N$18
  Top 0.406: U4.8 35.81,45.71 R23.2 35.52,47.97 R22.2
N$19  (via drill 0.4)
  Top 0.406: R24.2 v33.5,50.6
  Bottom 0.406: CN1.1 33.5,48 v33.5,50.6
N$20
  Top 0.254: R25.2 39.52,50.03 C24.1
  Top 0.406: R21.1 C24.1
N$21
  Top 0.406: U4.7 36.62,43.33 arc90 37.5,44.2 R21.2
OLED_CS  (via drill 0.4)
  Top 0.254: v14.5,37 v13.1,37 | v16.2,50.5 16.7,51 U3.26
  Bottom 0.254: v14.5,37 14.5,35.7 12,33.2 12,31.5 arc-90 11.5,31 9.5,31 8.19,29.69 U5.24 | v16.2,50.5 16.2,41.9 13.1,38.8 v13.1,37
OLED_DC  (via drill 0.4)
  Top 0.254: U3.25 v17.2,50.5
  Bottom 0.254: U5.22 8.23,32.23 9.5,33.5 11.5,33.5 13.8,35.8 13.8,38.6 17.2,42 v17.2,50.5
OLED_MOSI  (via drill 0.4)
  Top 0.254: U3.17 21.2,50.9 v20.8,50.5 | v14.5,38 v12.4,38
  Bottom 0.254: v14.5,38 14.5,38.5 18.2,42.2 18.2,47.9 v20.8,50.5 | v12.4,38 12.4,35.9 11.5,35 10.7,35 U5.19
OLED_RES  (via drill 0.4)
  Top 0.254: v15.2,50.5 U3.29
  Bottom 0.254: U5.18 8.31,37.31 9.5,38.5 12,38.5 15.2,41.7 v15.2,50.5
OLED_SCLK  (via drill 0.4)
  Top 0.254: U3.16 v21.7,50.5
  Bottom 0.254: U5.23 11.19,29.69 12.5,31 12.5,32.9 15.2,35.6 15.2,38.3 19.2,42.3 19.2,48 v21.7,50.5
PM_CE
  Top 0.254: U1.4 19.75,29.1 19.9,28.95 22.05,28.95 23.5,27.5 23.88,27.5 R7.2
PM_EN1
  Top 0.254: U1.6 22.25,30.75 23.5,32 23.58,32 R8.1 R9.2
PM_EN2
  Top 0.254: R10.1 R11.2 23.78,29 23.5,29 22.25,30.25 U1.5
PM_ILIM
  Top 0.254: U1.12 18.25,33.25 arc90 17.5,34 R1.2
PM_ISET
  Top 0.254: U1.16 17.5,30.23 17.5,29.8 16.1,28.4 15.98,28.4 R2.2
PM_SYSOFF  (via drill 0.4)
  Top 0.152: U1.15 17.04,30.75 16.95,30.84 15.35,30.84 arc90 v14.5,30
  Top 0.254: 36,30 S1.P$2 | 36,30 D2.C | 36,30 36,28 arc-90 35,27 v28,27
  Bottom 0.254: v14.5,30 14.5,27.5 arc90 15,27 v28,27
PM_TMR
  Top 0.152: U1.14 16.99,31.25 16.92,31.18 14.88,31.18
  Top 0.254: R3.2 13.8,30.1 arc-90 14.88,31.18
PM_TS
  Top 0.254: U1.1 18.25,28.87 R4.2
PWM0  (via drill 0.4)
  Top 0.254: R25.1 31.5,51.5 arc90 30,50 30,47.9 arc-90 29.1,47 29,47 arc90 28,46 28,43.5 arc-90 25,40.5 18.2,40.5 v12.5,46.2
  Bottom 0.254: U5.12 9.2,46.2 v12.5,46.2
V_BATT  (via drill 0.4)
  Top 0.254: v21.5,28 21.5,27.5 23,26 R12.2
  Top 0.406: U1.3 19.25,28.07 C1.1 19.2,28.15 18.75,28.15 | 18.7,28.15 18.75,28.15 | 18.75,28.15 U1.2
  Top 1.27: CN2.1 1.5,39 5,35.5 v17,35.5 | v21.5,28 19.22,28 C1.1
  Bottom 1.016: v16,35.5 v17,35.5
  Bottom 1.27: v17,35.5 19.5,35.5 arc-90 21.5,33.5 v21.5,28 v20.5,28
  pour Top (isolate 0.203, rank 2, no thermals): 18.5,29 18.5,27 20.6,27 20.6,29
V_USB
  Top 0.406: J1.VBUS 4.25,31.3 D1.C | U1.13 17.25,31.75 17,32 15.5,32
  Top 1.016: D1.C 4.55,31.55 5,32 15.5,32 15.98,32 C2.1
  pour Top (isolate 0.203, rank 2, no thermals): 18,31 18,33.2 4.5,33.2 2.3,31
VCC_AMP  (via drill 0.4)
  Top 0.254: U4.6 35.08,42.67 34.9,42.5 34.9,41.9 | R20.2 v29.7,46.3
  Top 0.406: C21.2 v37,40.8 37,42 arc90 36.33,42.67 U4.6
  Bottom 0.254: v29.7,46.3 29.7,42 arc90 31,40.7 36.9,40.7 v37,40.8
VSYS
  Top 0.254: R30.2 6.62,51 7,51 7.6,51.6 7.6,57.5 7.5,57.5 R5.2 | R26.1 25.5,39.5 25,39 25,32.5 25.1,32.4 R8.2 R10.2
  Top 0.406: U1.10 19.25,33.97 C3.1 | R6.2 R5.2 | U1.11 18.75,33.05
  Top 1.016: 22.98,39.5 R17.2 25.97,39.48 R26.1
  Top 1.27: 19.5,39.5 22.98,39.5 | C3.1 19.48,39.48 19.5,39.5 | 19.5,39.5 17,39.5 6.6,49.9 R30.2
  pour Top (rank 2, no thermals): 18.7,33 19.6,33 19.6,33.1 20.6,33.1 20.6,40 17,40 17,39 18,38 18,34.5 18.7,34
VSYS_AMP
  Top 0.406: U4.3 30.77,42.67 30.5,42.4 30.5,40.82 C20.2
  Top 1.016: R26.2 29.28,39.5 29.39,39.61 | 29.39,39.61 C20.2 | L2.P$1 31,38 29.39,39.61
  pour Top (isolate 0.203, rank 2, no thermals): 29,42.9 29,37 34.5,37 34.5,42.9
VSYS_LCD
  Top 0.254: U2.6 21.7,45.1 22.3,45.1 22.5,45.3 22.5,46.7 22.25,46.95 U2.4
  Top 0.406: U2.6 21.65,43.71 L1.P$1
  Top 1.016: C4.1 19.4,43.8 19.9,43.3 L1.P$1 22,43.24 22,41.8 22.28,41.52 R17.1
  pour Top (isolate 0.203, rank 2, no thermals): 22.5,45.5 22.5,41 18.5,41 18.5,45.5
VSYS_RPI  (via drill 0.4)
  Top 1.27: R30.1 v6.6,53.9 v6.6,55
  Bottom 1.016: U5.2 U5.4
  Bottom 1.27: v6.6,53.9 v6.6,55 7.84,55 U5.4

### Text on the board
tPlace: ON | OFF
bPlace: 3.7V / LiPo | +
tRestrict: VMU Zero V1.1 | hemkop11@gmail.com
Measures: All dimensions in mm